# EAGLE schematic Adafruit MacroPad 2040 (EAGLE 9.6.2)
COMPANY: ADAFRUIT INDUSTRIES; DRAWN: KTOWN; REV: A

## Sheet 1 of 2
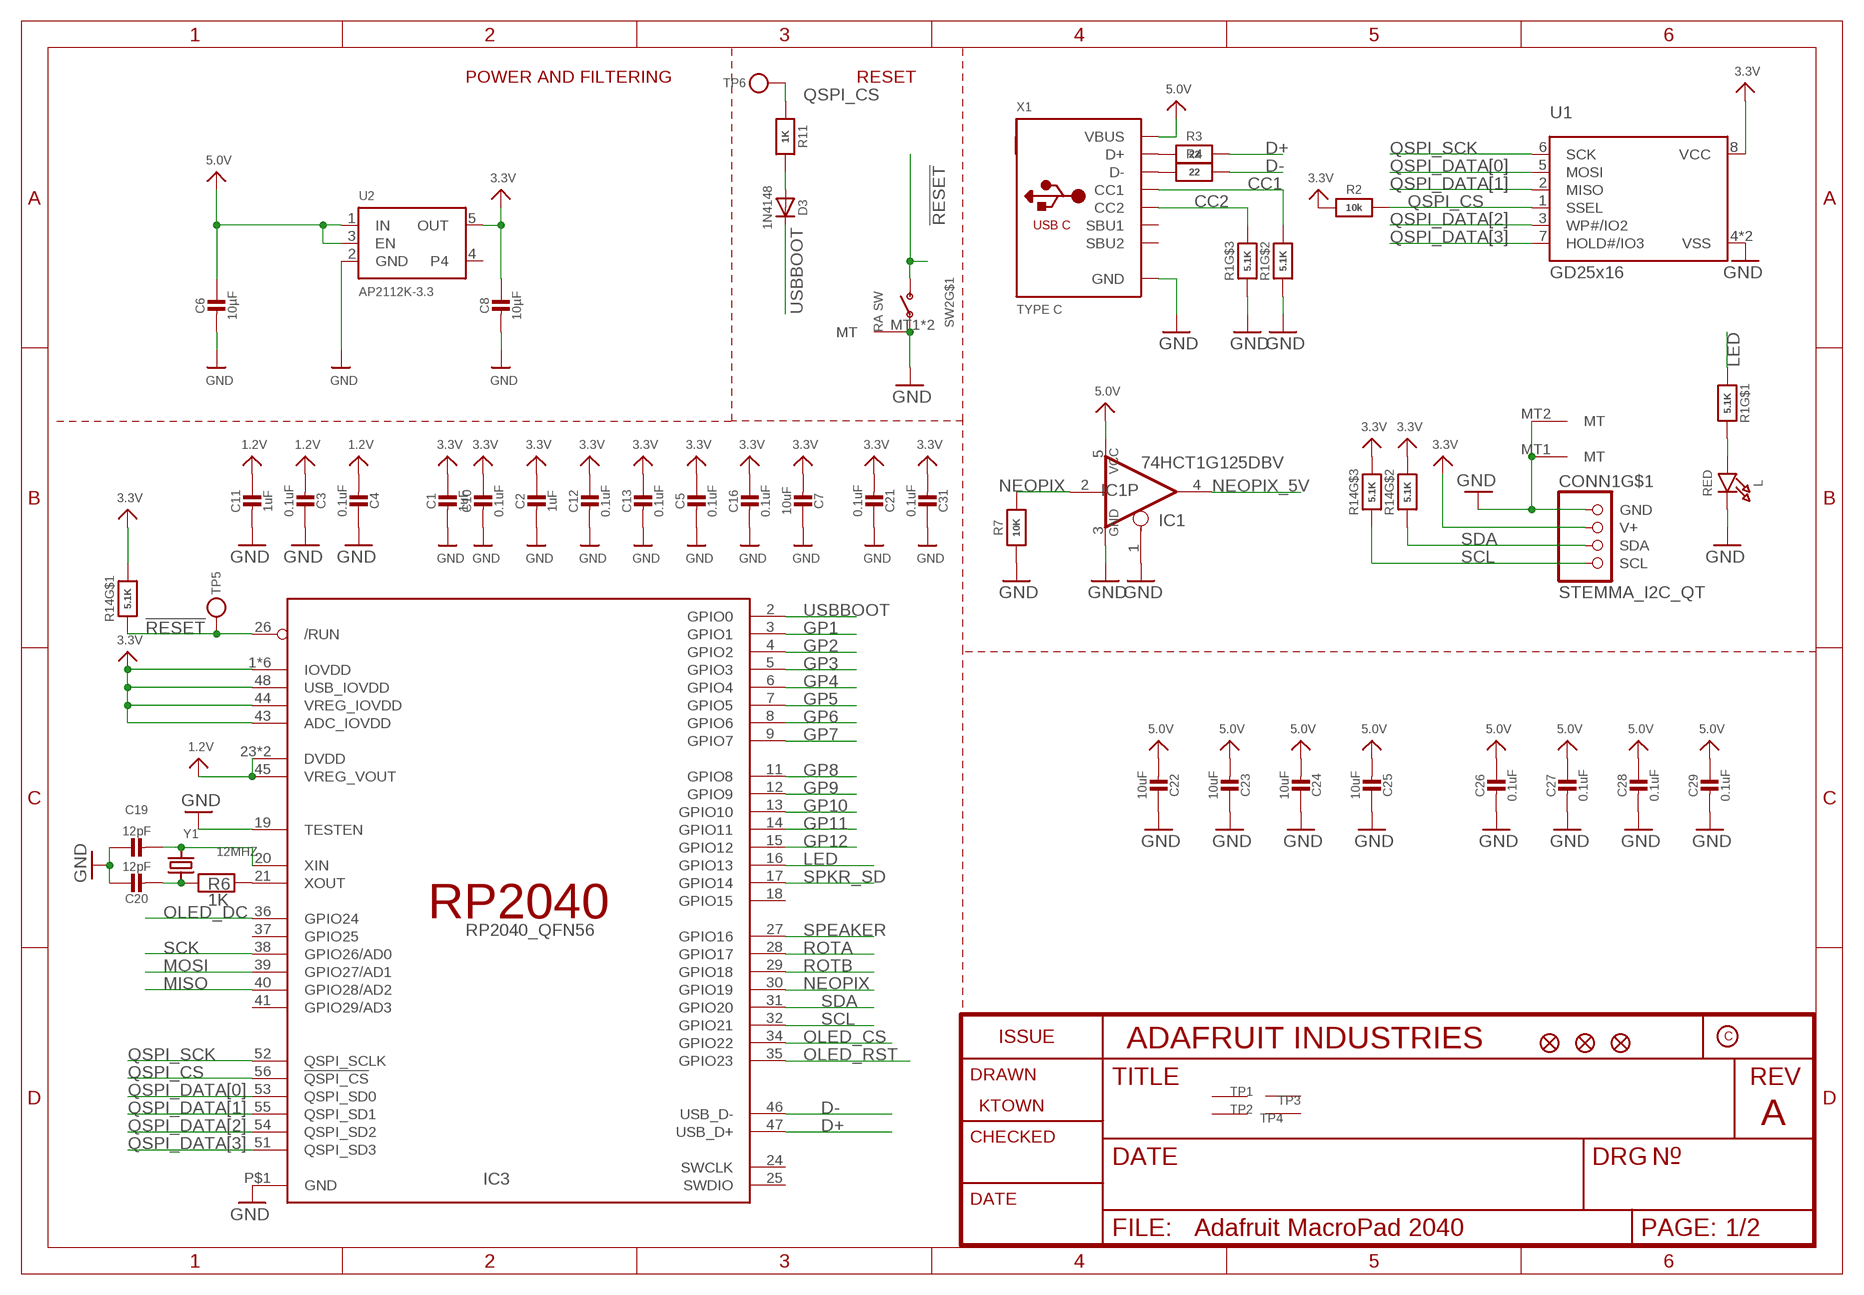
[diagram p0: schematic, sheet 1]

### Parts
C1  1uF  CAP_CERAMIC0603_NO  [0603-NO]
C2  1uF  CAP_CERAMIC0603_NO  [0603-NO]
C3  0.1uF  CAP_CERAMIC0603_NO  [0603-NO]
C4  0.1uF  CAP_CERAMIC0603_NO  [0603-NO]
C5  0.1uF  CAP_CERAMIC0603_NO  [0603-NO]
C6  10µF  CAP_CERAMIC0805-NOOUTLINE  [0805-NO]
C7  10uF  CAP_CERAMIC0805-NOOUTLINE  [0805-NO]
C8  10µF  CAP_CERAMIC0805-NOOUTLINE  [0805-NO]
C10  0.1uF  CAP_CERAMIC0603_NO  [0603-NO]
C11  1uF  CAP_CERAMIC0603_NO  [0603-NO]
C12  0.1uF  CAP_CERAMIC0603_NO  [0603-NO]
C13  0.1uF  CAP_CERAMIC0603_NO  [0603-NO]
C16  0.1uF  CAP_CERAMIC0603_NO  [0603-NO]
C19  12pF  CAP_CERAMIC0603_NO  [0603-NO]
C20  12pF  CAP_CERAMIC0603_NO  [0603-NO]
C21  0.1uF  CAP_CERAMIC0603_NO  [0603-NO]
C22  10uF  CAP_CERAMIC0805-NOOUTLINE  [0805-NO]
C23  10uF  CAP_CERAMIC0805-NOOUTLINE  [0805-NO]
C24  10uF  CAP_CERAMIC0805-NOOUTLINE  [0805-NO]
C25  10uF  CAP_CERAMIC0805-NOOUTLINE  [0805-NO]
C26  0.1uF  CAP_CERAMIC0603_NO  [0603-NO]
C27  0.1uF  CAP_CERAMIC0603_NO  [0603-NO]
C28  0.1uF  CAP_CERAMIC0603_NO  [0603-NO]
C29  0.1uF  CAP_CERAMIC0603_NO  [0603-NO]
C31  0.1uF  CAP_CERAMIC0603_NO  [0603-NO]
CONN1  STEMMA_I2C_QT  [JST_SH4]
D3  1N4148  DIODESOD-323  [SOD-323]
IC1  74HCT1G125DBV  74AHC1G125DBV  [SOT23-5]
IC3  RP2040_QFN56  [QFN56_7MM_REDUCEDEPAD]
L  RED  LED0603_NOOUTLINE  [CHIPLED_0603_NOOUTLINE]
R1  5.1K  RESISTOR_4PACK  [RESPACK_4X0603]
R2  10k  RESISTOR_0603_NOOUT  [0603-NO]
R3  22  RESISTOR_0603_NOOUT  [0603-NO]
R4  22  RESISTOR_0603_NOOUT  [0603-NO]
R6  1K  RESISTOR_0603_NOOUT  [0603-NO]
R7  10K  RESISTOR_0603_NOOUT  [0603-NO]
R11  1K  RESISTOR_0603_NOOUT  [0603-NO]
R14  5.1K  RESISTOR_4PACK  [RESPACK_4X0603]
SW2  RA SW  SWITCH_SPST_TACT_RA  [SPST_TACTILE_RA]
TP1  SEWTAP_SMTNUTM3  [SMT_NUT_3MM]
TP2  SEWTAP_SMTNUTM3  [SMT_NUT_3MM]
TP3  SEWTAP_SMTNUTM3  [SMT_NUT_3MM]
TP4  SEWTAP_SMTNUTM3  [SMT_NUT_3MM]
TP5  TESTPOINTROUND1.5MMNO  [TESTPOINT_ROUND_1.5MM_NO]
TP6  TESTPOINTROUND1.5MMNO  [TESTPOINT_ROUND_1.5MM_NO]
U1  GD25x16  SPIFLASH_8PIN_4X4  [USON8_4X4]
U2  AP2112K-3.3  VREG_SOT23-5  [SOT23-5]
U$34  FIDUCIAL_1MM  [FIDUCIAL_1MM]
U$35  FIDUCIAL_1MM  [FIDUCIAL_1MM]
U$80  FIDUCIAL_1MM  [FIDUCIAL_1MM]
X1  TYPE C  USB_C  [USB_C_CUSB31-CFM2AX-01-X]
Y1  12MHZ  CRYSTAL2.5X2.0  [CRYSTAL_2.5X2]

### Nets
1.2V: C3.2 C4.2 C11.1 IC3.23(DVDD) IC3.45(VREG_VOUT) IC3.50(DVDD)
3.3V [power]: C1.1 C2.1 C5.1 C7.2 C8.1 C10.1 C12.1 C13.1 C16.1 C21.2 C31.2 CONN1.2(V+) IC3.1(IOVDD) IC3.10(IOVDD) IC3.22(IOVDD) IC3.33(IOVDD) IC3.42(IOVDD) IC3.43(ADC_IOVDD) IC3.44(VREG_IOVDD) IC3.48(USB_IOVDD) IC3.49(IOVDD) R2.1 R14.6 R14.7 R14.8 U1.8(VCC) U2.5(OUT) ; also sheet 2
5.0V [5V]: C6.1 C22.2 C23.2 C24.2 C25.2 C26.1 C27.1 C28.1 C29.1 IC1.5(VCC) U2.1(IN) U2.3(EN) X1.A4B9(VBUS) X1.B4A9(VBUS) ; also sheet 2
!RESET: IC3.26(/RUN) R14.1 SW2.2(S) TP5.P$1
CC1: R1.7 X1.A5(CC1)
CC2: R1.6 X1.B5(CC2)
D+: IC3.47(USB_D+) R3.2
D-: IC3.46(USB_D-) R4.2
GND: C1.2 C2.2 C3.1 C4.1 C5.2 C6.2 C7.1 C8.2 C10.2 C11.2 C12.2 C13.2 C16.2 C19.1 C20.1 C21.1 C22.1 C23.1 C24.1 C25.1 C26.2 C27.2 C28.2 C29.2 C31.1 CONN1.1(GND) CONN1.MT1(MT) CONN1.MT2(MT) IC1.1(OE) IC1.3(GND) IC3.19(TESTEN) IC3.P$1(GND) L.C R1.2 R1.3 R7.1 SW2.1(P) SW2.MT1(MT) SW2.MT2(MT) U1.4(VSS) U1.PAD(VSS) U2.2(GND) X1.A1B12(GND) X1.B1A12(GND) ; also sheet 2
GP1: IC3.3(GPIO1) ; also sheet 2
GP2: IC3.4(GPIO2) ; also sheet 2
GP3: IC3.5(GPIO3) ; also sheet 2
GP4: IC3.6(GPIO4) ; also sheet 2
GP5: IC3.7(GPIO5) ; also sheet 2
GP6: IC3.8(GPIO6) ; also sheet 2
GP7: IC3.9(GPIO7) ; also sheet 2
GP8: IC3.11(GPIO8) ; also sheet 2
GP9: IC3.12(GPIO9) ; also sheet 2
GP10: IC3.13(GPIO10) ; also sheet 2
GP11: IC3.14(GPIO11) ; also sheet 2
GP12: IC3.15(GPIO12) ; also sheet 2
LED: IC3.16(GPIO13) R1.1
MISO: IC3.40(GPIO28/AD2)
MOSI: IC3.39(GPIO27/AD1) ; also sheet 2
N$1: R3.1 X1.A6(D+) X1.B6(D+)
N$2: L.A R1.8
N$3: R4.1 X1.A7(D-) X1.B7(D-)
N$4: D3.A R11.2
N$5: C19.2 IC3.20(XIN) Y1.3
N$6: C20.2 R6.1 Y1.1
N$7: IC3.21(XOUT) R6.2
NEOPIX: IC1.2(I) IC3.30(GPIO19) R7.2
NEOPIX_5V: IC1.4(O) ; also sheet 2
OLED_CS: IC3.34(GPIO22) ; also sheet 2
OLED_DC: IC3.36(GPIO24) ; also sheet 2
OLED_RST: IC3.35(GPIO23) ; also sheet 2
QSPI_CS: IC3.56(!QSPI_CS) R2.2 R11.1 TP6.P$1 U1.1(SSEL)
QSPI_DATA[0]: IC3.53(QSPI_SD0) U1.5(MOSI)
QSPI_DATA[1]: IC3.55(QSPI_SD1) U1.2(MISO)
QSPI_DATA[2]: IC3.54(QSPI_SD2) U1.3(WP#/IO2)
QSPI_DATA[3]: IC3.51(QSPI_SD3) U1.7(HOLD#/IO3)
QSPI_SCK: IC3.52(QSPI_SCLK) U1.6(SCK)
ROTA: IC3.28(GPIO17) ; also sheet 2
ROTB: IC3.29(GPIO18) ; also sheet 2
SCK: IC3.38(GPIO26/AD0) ; also sheet 2
SCL: CONN1.4(SCL) IC3.32(GPIO21) R14.3
SDA: CONN1.3(SDA) IC3.31(GPIO20) R14.2
SPEAKER: IC3.27(GPIO16) ; also sheet 2
SPKR_SD: IC3.17(GPIO14) ; also sheet 2
USBBOOT: D3.C IC3.2(GPIO0) ; also sheet 2
Unconnected: IC3.18(GPIO15) IC3.24(SWCLK) IC3.25(SWDIO) IC3.37(GPIO25) IC3.41(GPIO29/AD3) R1.4 R1.5 TP1.P$1(SEW) TP2.P$1(SEW) TP3.P$1(SEW) TP4.P$1(SEW) U2.4 X1.A8(SBU1) X1.B8(SBU2)

### Notes on the sheet
- POWER AND FILTERING | RESET

## Sheet 2 of 2
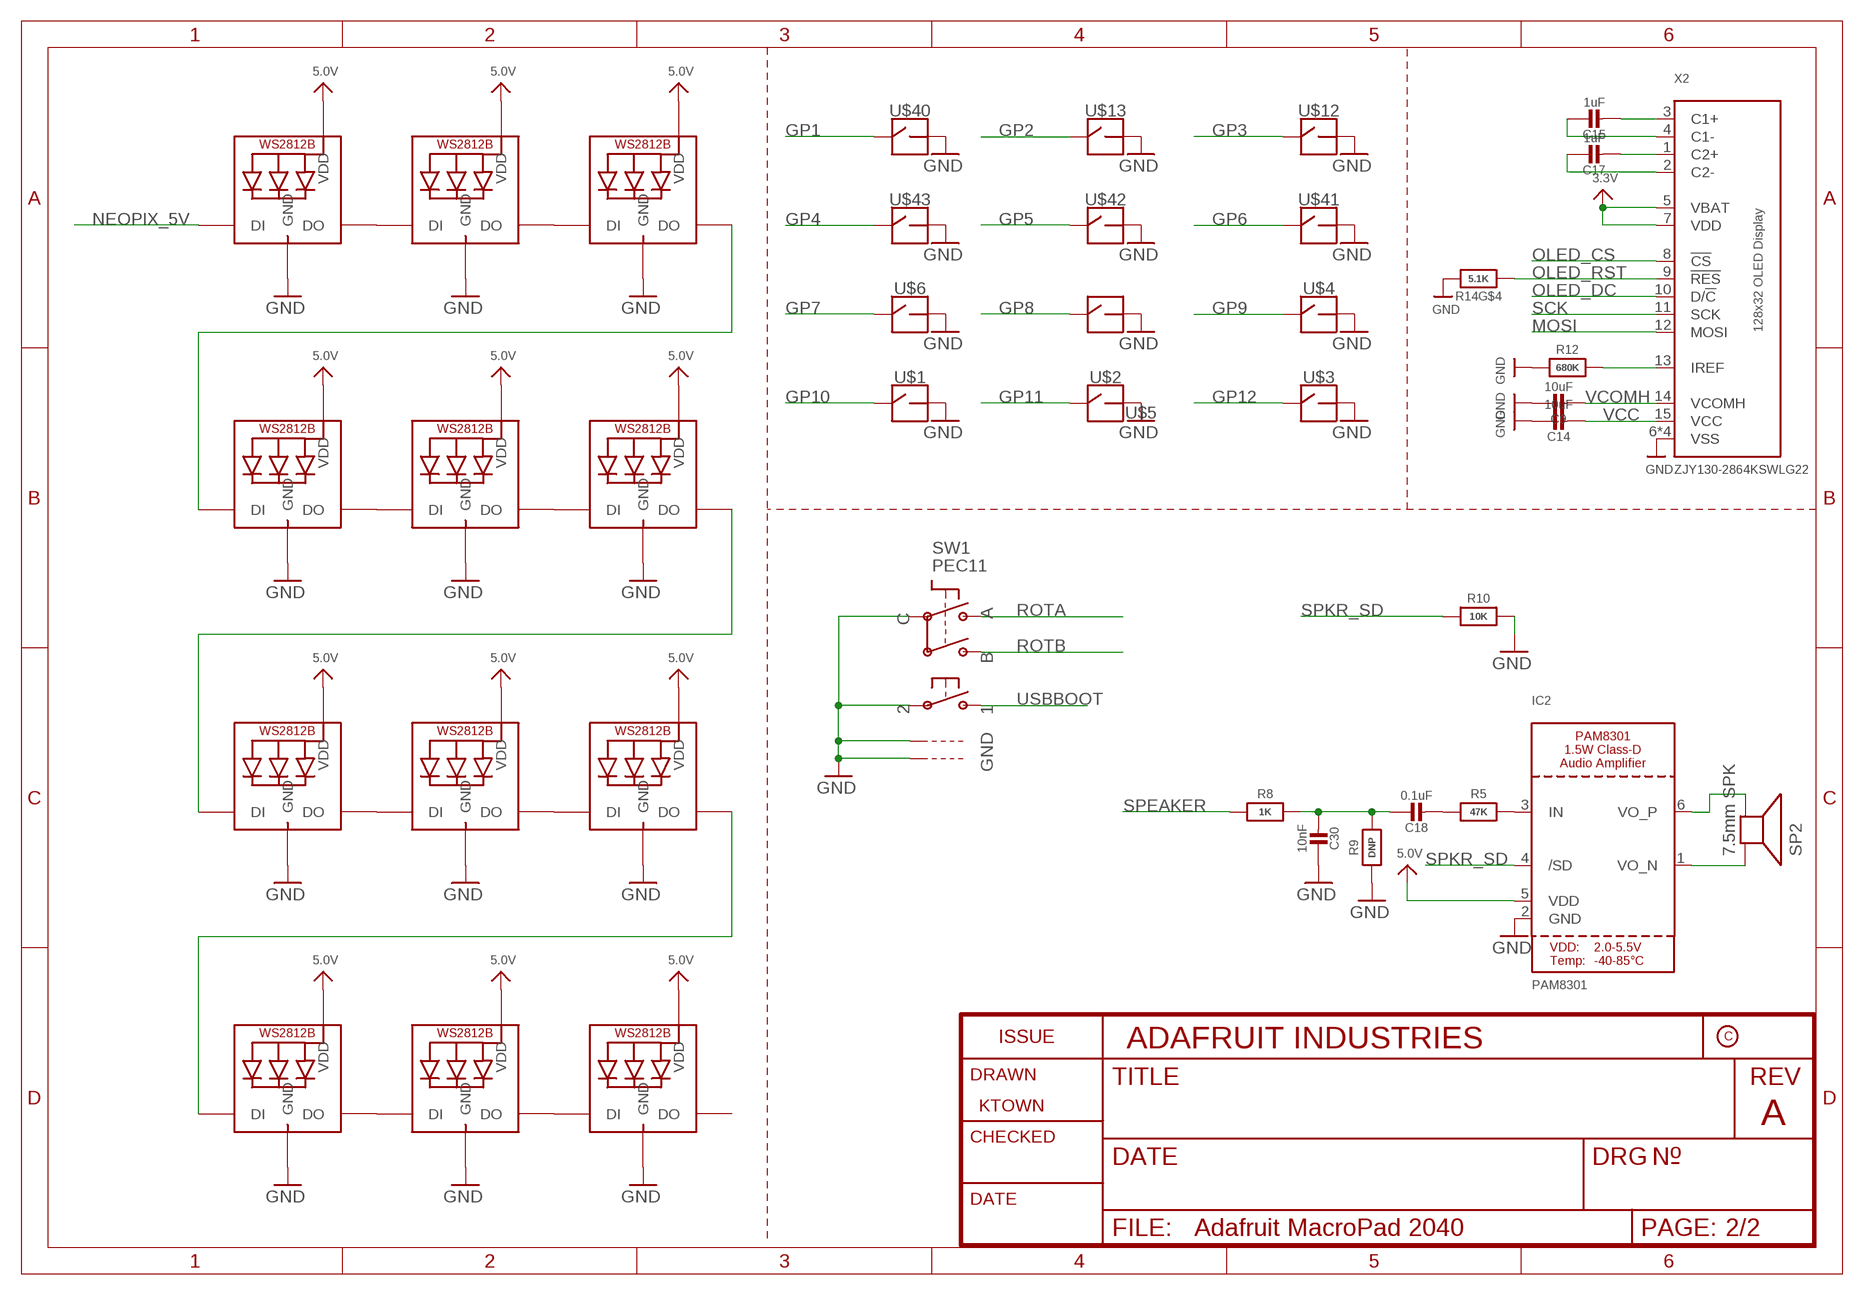
[diagram p1: schematic, sheet 2]

### Parts
C9  10uF  CAP_CERAMIC0805-NOOUTLINE  [0805-NO]
C14  10uF  CAP_CERAMIC0805-NOOUTLINE  [0805-NO]
C15  1uF  CAP_CERAMIC0603_NO  [0603-NO]
C17  1uF  CAP_CERAMIC0603_NO  [0603-NO]
C18  0.1uF  CAP_CERAMIC0603_NO  [0603-NO]
C30  10nF  CAP_CERAMIC0603_NO  [0603-NO]
IC2  PAM8301  [SOT23-6]
LED1  WS2812B_SK6812E  [NEO3535_REVERSE]
LED2  WS2812B_SK6812E  [NEO3535_REVERSE]
LED3  WS2812B_SK6812E  [NEO3535_REVERSE]
LED4  WS2812B_SK6812E  [NEO3535_REVERSE]
LED5  WS2812B_SK6812E  [NEO3535_REVERSE]
LED6  WS2812B_SK6812E  [NEO3535_REVERSE]
LED7  WS2812B_SK6812E  [NEO3535_REVERSE]
LED8  WS2812B_SK6812E  [NEO3535_REVERSE]
LED9  WS2812B_SK6812E  [NEO3535_REVERSE]
LED10  WS2812B_SK6812E  [NEO3535_REVERSE]
LED11  WS2812B_SK6812E  [NEO3535_REVERSE]
LED12  WS2812B_SK6812E  [NEO3535_REVERSE]
R5  47K  RESISTOR_0603_NOOUT  [0603-NO]
R8  1K  RESISTOR_0603_NOOUT  [0603-NO]
R9  DNP  RESISTOR_0603_NOOUT  [0603-NO]
R10  10K  RESISTOR_0603_NOOUT  [0603-NO]
R12  680K  RESISTOR_0603_NOOUT  [0603-NO]
SP2  7.5mm SPK  SPEAKER_7.5MM  [BUZZER_SMT_7.5MM]
SW1  PEC11  ENCODER_PLUS_SWITCH_BOURNS_PEC11  [PEC11+SWITCH]
U$1  SOCKET  KBD_SWITCH_KAILH_SOCKETBOX_JADE_KAILH_SOCKET  [KAILH_SOCKET]
U$2  SOCKET  KBD_SWITCH_KAILH_SOCKETBOX_JADE_KAILH_SOCKET  [KAILH_SOCKET]
U$3  SOCKET  KBD_SWITCH_KAILH_SOCKETBOX_JADE_KAILH_SOCKET  [KAILH_SOCKET]
U$4  SOCKET  KBD_SWITCH_KAILH_SOCKETBOX_JADE_KAILH_SOCKET  [KAILH_SOCKET]
U$5  SOCKET  KBD_SWITCH_KAILH_SOCKETBOX_JADE_KAILH_SOCKET  [KAILH_SOCKET]
U$6  SOCKET  KBD_SWITCH_KAILH_SOCKETBOX_JADE_KAILH_SOCKET  [KAILH_SOCKET]
U$12  SOCKET  KBD_SWITCH_KAILH_SOCKETBOX_JADE_KAILH_SOCKET  [KAILH_SOCKET]
U$13  SOCKET  KBD_SWITCH_KAILH_SOCKETBOX_JADE_KAILH_SOCKET  [KAILH_SOCKET]
U$40  SOCKET  KBD_SWITCH_KAILH_SOCKETBOX_JADE_KAILH_SOCKET  [KAILH_SOCKET]
U$41  SOCKET  KBD_SWITCH_KAILH_SOCKETBOX_JADE_KAILH_SOCKET  [KAILH_SOCKET]
U$42  SOCKET  KBD_SWITCH_KAILH_SOCKETBOX_JADE_KAILH_SOCKET  [KAILH_SOCKET]
U$43  SOCKET  KBD_SWITCH_KAILH_SOCKETBOX_JADE_KAILH_SOCKET  [KAILH_SOCKET]
X2  ZJY130-2864KSWLG22  [ZJY130-2864KSWLG22]

### Nets
3.3V [power]: X2.5(VBAT) X2.7(VDD) ; also sheet 1
5.0V [5V]: IC2.5(VDD) LED1.1-VDD(VDD) LED2.1-VDD(VDD) LED3.1-VDD(VDD) LED4.1-VDD(VDD) LED5.1-VDD(VDD) LED6.1-VDD(VDD) LED7.1-VDD(VDD) LED8.1-VDD(VDD) LED9.1-VDD(VDD) LED10.1-VDD(VDD) LED11.1-VDD(VDD) LED12.1-VDD(VDD) ; also sheet 1
GND: C9.1 C14.1 C30.1 IC2.2(GND) LED1.3-GND(GND) LED2.3-GND(GND) LED3.3-GND(GND) LED4.3-GND(GND) LED5.3-GND(GND) LED6.3-GND(GND) LED7.3-GND(GND) LED8.3-GND(GND) LED9.3-GND(GND) LED10.3-GND(GND) LED11.3-GND(GND) LED12.3-GND(GND) R9.1 R10.2 R12.1 R14.5 SW1.P$2 SW1.P$C SW1.P$GND1 SW1.P$GND2 U$1.2 U$2.2 U$3.2 U$4.2 U$5.2 U$6.2 U$12.2 U$13.2 U$40.2 U$41.2 U$42.2 U$43.2 X2.6(VSS) X2.16(VSS) X2.SUPPORT1(VSS) X2.SUPPORT2(VSS) ; also sheet 1
GP1: U$40.1 ; also sheet 1
GP2: U$13.1 ; also sheet 1
GP3: U$12.1 ; also sheet 1
GP4: U$43.1 ; also sheet 1
GP5: U$42.1 ; also sheet 1
GP6: U$41.1 ; also sheet 1
GP7: U$6.1 ; also sheet 1
GP8: U$5.1 ; also sheet 1
GP9: U$4.1 ; also sheet 1
GP10: U$1.1 ; also sheet 1
GP11: U$2.1 ; also sheet 1
GP12: U$3.1 ; also sheet 1
MOSI: X2.12(MOSI) ; also sheet 1
N$8: C18.2 R5.1
N$9: IC2.3(IN) R5.2
N$10: LED1.2-DOUT(DO) LED2.4-DIN(DI)
N$11: LED2.2-DOUT(DO) LED3.4-DIN(DI)
N$12: LED4.2-DOUT(DO) LED5.4-DIN(DI)
N$13: LED5.2-DOUT(DO) LED6.4-DIN(DI)
N$14: LED7.2-DOUT(DO) LED8.4-DIN(DI)
N$15: LED8.2-DOUT(DO) LED9.4-DIN(DI)
N$16: LED10.2-DOUT(DO) LED11.4-DIN(DI)
N$17: LED11.2-DOUT(DO) LED12.4-DIN(DI)
N$18: LED3.2-DOUT(DO) LED4.4-DIN(DI)
N$19: LED6.2-DOUT(DO) LED7.4-DIN(DI)
N$20: LED9.2-DOUT(DO) LED10.4-DIN(DI)
N$21: R12.2 X2.13(IREF)
N$22: IC2.1(VO_N) SP2.+
N$23: C17.1 X2.2(C2-)
N$24: C17.2 X2.1(C2+)
N$25: C15.1 X2.4(C1-)
N$26: C15.2 X2.3(C1+)
N$27: IC2.6(VO_P) SP2.-
N$100: C18.1 C30.2 R8.2 R9.2
NEOPIX_5V: LED1.4-DIN(DI) ; also sheet 1
OLED_CS: X2.8(!CS) ; also sheet 1
OLED_DC: X2.10(D/!C) ; also sheet 1
OLED_RST: R14.4 X2.9(!RES) ; also sheet 1
ROTA: SW1.P$A ; also sheet 1
ROTB: SW1.P$B ; also sheet 1
SCK: X2.11(SCK) ; also sheet 1
SPEAKER: R8.1 ; also sheet 1
SPKR_SD: IC2.4(/SD) R10.1 ; also sheet 1
USBBOOT: SW1.P$1 ; also sheet 1
VCC: C14.2 X2.15(VCC)
VCOMH: C9.2 X2.14(VCOMH)
Unconnected: LED12.2-DOUT(DO)

## Library data of the parts
C1-C7 C9-C31 = microbuilder:CAP_CERAMIC: Ceramic Capacitors For new designs, use the packages preceded by an '_' character since they are more reliable: The following footprints should be used on most boards: _0402 - Standard footprint for regular board layouts _0603 - Standard footprint for regular board layouts _0805 - Standard footprint for regular board layouts _1206 - Standard footprint for regular board layouts For extremely tight-pitch boards where space is at a premium, the following 'micro-pitch' footprints can be used (smaller pads, no silkscreen outline, etc.): _0402MP - Micro-pitch footprint for very dense/compact boards _0603MP - Micro-pitch footprint for very dense/compact boards _0805MP - Micro-pitch footprint for very dense/compact boards _1206MP - Micro-pitch footprint for very dense/compact boards
C8 = microbuilder:CAP_CERAMIC: Ceramic Capacitors For new designs, use the packages preceded by an '_' character since they are more reliable: The following footprints should be used on most boards: _0402 - Standard footprint for regular board layouts _0603 - Standard footprint for regular board layouts _0805 - Standard footprint for regular board layouts _1206 - Standard footprint for regular board layouts For extremely tight-pitch boards where space is at a premium, the following 'micro-pitch' footprints can be used (smaller pads, no silkscreen outline, etc.): _0402MP - Micro-pitch footprint for very dense/compact boards _0603MP - Micro-pitch footprint for very dense/compact boards _0805MP - Micro-pitch footprint for very dense/compact boards _1206MP - Micro-pitch footprint for very dense/compact boards; REV: C
CONN1 = microbuilder:STEMMA_I2C
D3 = microbuilder:DIODE: Diode SMA Model Volts Amps Type Vf Ir Digikey # Notes SSA34-E3 40V 3A Schottky 480mV @ 3A 200uA @ 40V SSA34-E3/61TGITR-ND CDBA120-G 20V 1A Schottky 500mV @ 1A 500uA @ 20V 641-1014-6-ND REEL MBRA210 10V 2A Schottky 350mV @ 2A 700uA @ 10V MBRA210LT3 SOD-123 Model Volts Amps Type Vf Ir Order # Notes BAT54T1G 30V 200mA Schottky 800mV @ 200mA 2uA @ 25V BAT54T1GOSTR-ND B0530W 30V 500mA Schottky 430mV @ 500mA 130uA @ 30V B0530W-FDICT-ND REEL MBR120 20V 1A Schottky 340mV @ 1A MBR120VLSFT1GOSCT-ND SOD-323 Model Volts Amps Type Vf Ir Order # Notes PMEG2005EJ 20V 500mA Schottky 355mV @ 500mA 568-4110-1-ND ZLLS410 10V 570mA Schottky 380mV @ 570mA ZLLS410CT-ND 1N4148WS 75V 150mA Silicon/Simple 1V 1N4148WSFSCT-ND REEL SOD-523 Model Volts Amps Type Vf Ir Order # Notes BAT54XV2 30V 200mA Schottky 0.8V @ 100mA BAT54XV2CT-ND TB751S 30V 30mA Schottky RB751S-40TE61CT-ND SOT23-R/W (R = Solder Paste/Reflow Ovens, W = Hand-Soldering) Model Volts Amps Type Vf Ir Order # Notes BAT54FILM 40V 300mA Schottky 497-7162-1-ND POWERDI-5 Model Volts Amps Type Vf Ir Order # Notes PDS560 60V 5A Schottky 670mV @ 5A 150uA @ 60V PDS560DICT-ND
IC1 = 74xx-little-us:74*1G125: Single Bus Buffer Gate with 3-State Output
IC2 = microbuilder:PAM8301
IC3 = adafruit_micro:RP2040
L = microbuilder:LED: LED 0603 - 0603 Surface Mount Package 2mA: Green LED - Low Power (3.9mcd, 2ma, 1.7Vf) - Digikey: 475-2709-2-ND Orange LED - Low Power (9.8mcd, 2ma, 1.8Vf) - Digikey: 475-1194-2-ND Red LED - Low Power (5mcd, 2ma, 1.8Vf) - Digikey: 475-1195-2-ND Yellow LED - Low Power (7mcd, 2ma, 1.8Vf) - Digikey: 475-1196-2-ND 5mA: Blue LED - Low Power (17mcd, 5ma, 2.9Vf) - Digikey: LNJ937W8CRACT-ND 0805 - 0805 Surface Mount Package 2mA: Red LED (8.8mcd, 2mA, 1.8Vf, Clear) - Low Power [Digikey: 475-2510-1-ND] Green LED (5mcd, 2mA, 1.8Vf, Clear) - Low Power [Digikey: 475-2730-1-ND] Yellow LED (11.3mcd, 2mA, 1.8Vf, Clear) - Low Power [Digikey: 475-2555-1-ND] 20mA: Red LED (104mcd, 20mA, Diffused) - LS R976 [Digikey: 475-1278-6-ND] Red LED (12mcd, 20mA, 2.0Vf, Clear) - APT2012EC [Digikey: 754-1128-1-ND] Green LED (15mcd, 20mA, 2.2Vf, Clear) - APT2012GC [Digikey: 754-1131-1-ND] Orange LED (160mcd, 20mA, 2.1Vf, Clear) - APT2012SECK [Digikey: 754-1130-1-ND] 1206 - 1206 Surface Mount Package Green LED (26mcd, 20mA, Diffused) - LG N971 [Digikey: 475-1407-6-ND] Red LED (15mcd, 20mA, Diffused) - LH N974 [Digikey: 475-1416-6-ND] Cree - Cree High-Power Surface Mount LEDs XPEBWT-L1-0000-00D50 - White 111lm 350mA 2.9Vf 6200K 110° XTEAWT-00-0000-00000LEE3 - White 114lm 350mA 2.85Vf 5000K 115° Everlight - Everlight 45-21 Series Surface Mount LEDs 45-21/QK2C-B2832AC2CB2/2T - Warm White 2000mcd 20mA 3.25Vf 3050K 120° 45-21/LK2C-B38452C4CB2/2T - Nuetral White 2000mcd 20mA 3.25Vf 4150K 120° 45-21/LK2C-B50634C6CB2/2T - Cold White 2200mcd 20mA 3.25Vf 5650K 120° PLCC2 Reverse Mount LS T77K-J1L2-1-0-2-R18-Z - Red 11.25mcd 2mA 1.8Vf 630nm 120° LO T77K-L1M2-24-Z - Orange 19.6mcd 2mA 1.8Vf 606nm 120° LY T77K-K2M1-26-Z - Yellow 15.7mcd 2mA 1.8Vf 587nm 120°
LED1-LED12 = microbuilder:WS2812B
R1 R14 = microbuilder:RESISTOR_4PACK: Resistor Packs (4 resistors) 4 x 0603 10K 1/16W - Digikey: YC164J-10KCT-ND
R2-R12 = microbuilder:RESISTOR: Resistors For new designs, use the packages preceded by an '_' character since they are more reliable: The following footprints should be used on most boards: _0402 - Standard footprint for regular board layouts _0603 - Standard footprint for regular board layouts _0805 - Standard footprint for regular board layouts _1206 - Standard footprint for regular board layouts For extremely tight-pitch boards where space is at a premium, the following 'micro-pitch' footprints can be used (smaller pads, no silkscreen outline, etc.): _0402MP - Micro-pitch footprint for very dense/compact boards _0603MP - Micro-pitch footprint for very dense/compact boards _0805MP - Micro-pitch footprint for very dense/compact boards _1206MP - Micro-pitch footprint for very dense/compact boards
SP2 = microbuilder:SPEAKER: SPEAKER Source: Buerklin Added PS12 (for part # PS1240 piezo) http://www.ladyada.net/library/pcb/eaglelibrary.html
SW1 = adafruit_electromech:ENCODER_PLUS_SWITCH: Rotary Encoder with Built-In Switch PEC11 - 24 Step, PEC11-4215F-S24 - http://www.adafruit.com/products/377
SW2 = adafruit_electromech:SWITCH_SPST: Switch - SPST 4UCon 19192 (6.7x2.6mm SMT)
TP1-TP4 = adafruit_electromech:SEWTAP
TP5 TP6 = microbuilder:TESTPOINT: Test Point Various test points for characterisation and PCB testing TESTPOINT_SMT - Compact Surface Mount Test Point [Digikey: 5016KTR-ND]
U1 = microbuilder:SPIFLASH_8PIN: SOIC8 SPI Flash Be careful with the size since SOIC8 flash comes in several 'widths' SOIC8 150 mil M25P16 - 16Mbit (2Mbit x 8) Serial Flash (75MHz SPI Bus), Supply: 2.7-3.6V Digikey: SOIC8 - M25P16-VMN6P-ND SOIC8 208 mil W25Q16BVSSIG - 16Mbit (2Mbit x 8) Serial Flash (104MHz SPI Bus), Supply: 2.7-3.6V Digikey: SOIC8 - W25Q16BVSSIG-ND
U2 = microbuilder:VREG_SOT23-5: SOT23-5 Fixed Voltage Regulators Part Current Out V Out V In V Dropout θJA (°C/W) TJ (°C) Digikey Part No. ADP121 150mA 3.3V 3.4-5.5V 0.09V @ 150mA -- -- ADP121-AUJZ33R7CT-ND ADP121 150mA 3.0V 3.1-5.5V 0.09V @ 150mA -- -- ADP121-AUJZ30R7CT-ND ADP122 300mA 3.3V 3.4-5.5V 0.085V @ 300mA -- -- ADP122AUJZ-3.3-R7CT-ND ADP1712 300mA 3.3V 3.5-5.5V 0.17V @ 300mA -- -- ADP1712AUJZ-3.3-R7TR-ND AP7311 (Low Cost) 150mA 3.3V 3.5-6V 0.15V @ 150mA -- -- AP7311-33WG-7DICT-ND LD39015M18R 150mA 1.8V 1.9V-5.5V 0.08V @ 100mA -- -- 497-6977-1-ND LP2985A-33DBVR 150mA 3.3V 3.3-16V 0.28V @ 150mA 206 150 296-18479-1-ND MCP1824T-3302E/OT 300mA 3.3V 3.5V-6V 0.2V @ 300mA -- -- MCP1824T-3302E/OTCT-ND MIC5205-2.5YM5 TR 150mA 2.5V 2.7-16V 0.165V @ 150mA -- -- 576-1257-2-ND MIC5205-3.0YM5 TR 150mA 3.0V 3.2V-16V 0.165V @ 150mA -- -- 576-1258-2-ND MIC5205-3.3YM5 TR 150mA 3.3V 3.5V-16V 0.165V @ 150mA -- -- 576-1259-2-ND TPS780330220 150mA 3.3V+2.2V 3.6-5.5V 250mV Max -- -- 296-23332-1-ND TDA3663/N1,135 100mA 3.3V 3.5-45V 0.18V @ 50mA -- -- 568-5343-1-ND Max operating temp can be calculated using θJA, TJ (max junction temperature), and power in watts. Set the "Maximum Ambient Temperature" until it reaches TJ ("Max Junction Temperature"), which is the absolute limit for safe use of the regulator: Heat Sink Temperature Calculator <http://www.daycounter.com/Calculators/Heat-Sink-Temperature-Calculator.phtml> For example, With 12V source into a 3.3V LP2985 and a 30mA load, we are dissipating (12V-3.3V) * 0.03A = 0.261W. With a θJA of 206 °C/W, a TJ of 150°C, and 261mW we can safely use the chip without a heat sink up to 75°C (=147.1°C Junction Temperature).
U$1-U$6 U$12 U$13 U$40-U$43 = adafruit_electromech:KBD_SWITCH_KAILH_SOCKET
U$34 U$35 U$80 = microbuilder:FIDUCIAL: Fiducial Alignment Points Various fiducial points for machine vision alignment.; BOM: EXCLUDE
X1 = adafruit_electromech:USB_C: USB Type-C USB 2.0 Connector
X2 = adafruit_display:ZJY130-2864KSWLG22
Y1 = microbuilder:CRYSTAL: Crystals HC49UP - Surface Mount Crystal 4.0MHz 18pF +/-30ppm Surface Mount Crystal [Digikey: 535-9857-1-ND] 12.0 MHz Surface Mount Crystal [Digikey: 535-9869-6-ND] 25.0 MHz Surface Mount Crystal [Digikey: 535-9078-1-ND] 2.5 x 2.0mm - MEMs SMT Crystal 16.0 MHz 10pF 20ppm 2.5 x 2.0mm Crystal [Digikey -40-85°C: 535-10923-1-ND] 3.2 x 2.5mm - MEMs SMT Crystal 12.0 MHz 8pF 15ppm 3.2 x 2.5mm Crystal [Digikey: -10-70°C: 644-1047-1-ND -40-125°C: 644-1128-1-ND] 40~85°C cheaper: 644-1173-6-ND 16.0 MHz 8pF 15ppm 3.2 x 2.5mm Crystal [Digikey: -10-70°C: 644-1049-1-ND -40-125°C: 644-1129-2-ND]-40~85°C cheaper: 644-1175-6-ND 16.0 MHz 10pF 10ppm 3.2 x 2.5mm Crystal [Digikey: 644-1100-1-ND] 27.12 MHz 18pF 30ppm 3.2 x 2.5mm Crystal [Digikey: 887-1424-1-ND] 27.12MHz 10pF 10ppm 3.2 x 2.5mm Crystal [Digikey: 887-1329-1-ND] 4.9 x 1.8mm - MEMs SMT Crystal 32.768 KHz 12.5pF 20ppm 4.9 x 1.8mm Crystal [Digikey: SE2415CT-ND] 8.0 x 3.8mm - Surface Mount Crystal 32.768kHz 12.5pF 20ppm -40°C-85°C [Digikey: 535-9166-2-ND] Cylinder 32.768KHz Cylinder Crystal (2x6mm body) [Ex. Digikey: 300-8341-2-ND]

## Net classes
0 default: width 0.178 mm
1 power: width 0.254 mm
2 5V: width 0.406 mm, drill 0.483 mm